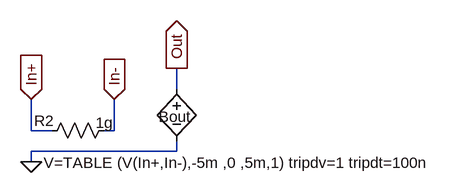
[diagram p0: schematic Comph.asc]
Comph.asc, the LTspice schematic file:
Version 4
SHEET 1 880 680
WIRE -16 320 -16 272
WIRE -16 368 -16 352
WIRE 16 320 -16 320
WIRE 112 320 96 320
WIRE 112 320 112 272
WIRE 208 256 208 224
WIRE 208 352 -16 352
WIRE 208 352 208 336
FLAG -16 272 In+
IOPIN -16 272 In
FLAG 112 272 In-
IOPIN 112 272 In
FLAG 208 224 Out
IOPIN 208 224 Out
FLAG -16 368 0
SYMBOL res 112 304 R90
WINDOW 0 16 108 VBottom 0
WINDOW 3 -12 15 VTop 0
SYMATTR InstName R2
SYMATTR Value 1g
SYMBOL bv 208 240 R0
WINDOW 0 -28 59 Left 0
WINDOW 3 -205 129 Left 0
SYMATTR InstName Bout
SYMATTR Value V=TABLE (V(In+,In-),-5m ,0 ,5m,1) tripdv=1 tripdt=100n

The netlist it stands for:
* Comph.asc
R2 In- In+ 1g
Bout Out 0 V=TABLE (V(In+,In-),-5m ,0 ,5m,1) tripdv=1 tripdt=100n
.backanno
.end